# Altium schematic sheet SheildLattePanda.SchDoc
size A; SheetNumber: 2; SheetTotal: 3
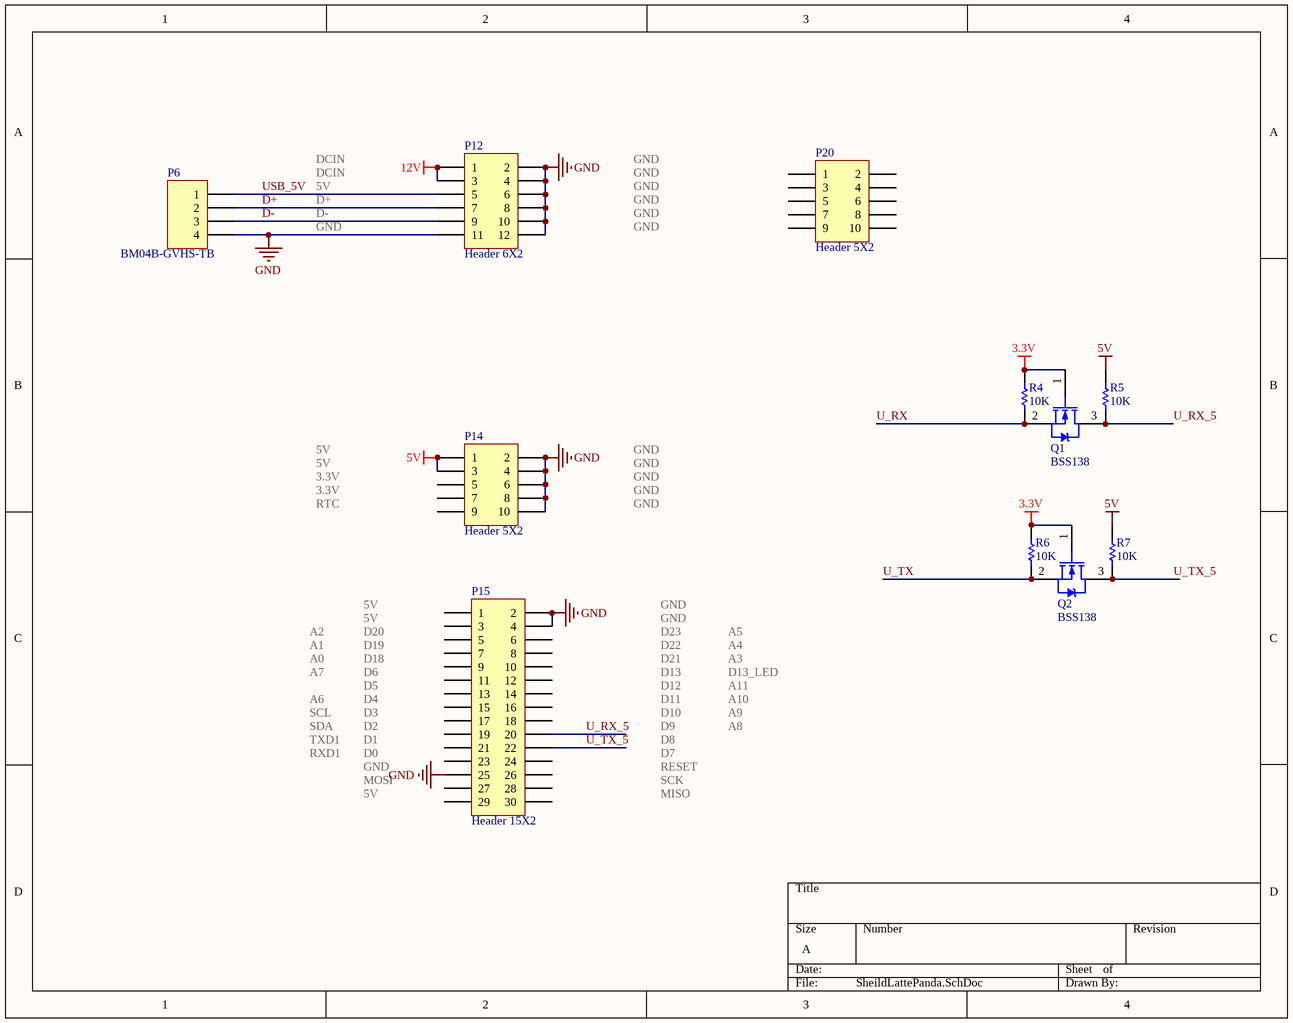
[diagram p0: SheildLattePanda.SchDoc]

## Parts
P6  BM04B-GVHS-TB  [CONN-SM04B-GHSV-TB - INVERTED]
P12  Header 6X2  [CONN-2x6_0_1INCH_SMT - duplicate - duplicate]
P14  Header 5X2  [CONN-2x5_0_1INCH_SMT - duplicate]
P15  Header 15X2  [CONN-2x15_0_1INCH_SMT]
P20  Header 5X2  [CONN-2x5_0_1INCH_SMT - duplicate]
Q1  BSS138  [SOT-23]
Q2  BSS138  [SOT-23]
R4  value 10K  [R0402]  (hidden comment: Res1)
R5  value 10K  [R0402]  (hidden comment: Res1)
R6  value 10K  [R0402]  (hidden comment: Res1)
R7  value 10K  [R0402]  (hidden comment: Res1)

## Nets
3.3V: Q1.1(G) Q2.1(G) R4.1 R6.1
5V: P14.1 P14.3 R5.1 R7.1
12V: P12.1 P12.3
GND: P6.4 P12.2 P12.4 P12.6 P12.8 P12.10 P12.11 P12.12 P14.2 P14.4 P14.6 P14.8 P14.10 P15.2 P15.4 P15.25
D+: P6.2 P12.7
D-: P6.3 P12.9
U_RX: Q1.2(S) R4.2
U_RX_5: P15.20 Q1.3(D) R5.2
U_TX: Q2.2(S) R6.2
U_TX_5: P15.22 Q2.3(D) R7.2
USB_5V: P6.1 P12.5

Not connected (* = marked no-connect by the designer): P14 5 7 9; P15 1 3 5 6 7 8 9 10 11 12 13 14 15 16 17 18 19 21 23 24 26 27 28 29 30; P20 1 2 3 4 5 6 7 8 9 10

## Notes on the sheet
- DCIN
- GND
- 5V
- D+
- D-
- 3.3V
- RTC
- A2
- D20
- D23
- A5
- A1
- A0
- A7
- A6
- D19
- D18
- D6
- D5
- D4
- D22
- D21
- D13
- D12
- D11
- A4
- A3
- D13_LED
- A11
- A10
- SCL
- SDA
- TXD1
- RXD1
- D3
- D2
- D1
- D0
- D10
- D9
- D8
- D7
- RESET
- A9
- A8
- MOSI
- SCK
- MISO

## Library data of the parts
P6 = Header 4: Conn Header SMD 4POS 1.25MM; Manufacturer: JST; Supplier 1: DigiKey; Supplier Part Number 1: 455-BM04B-GVHS-TBCT-ND; Manufacturer Part Number: BM04B-GVHS-TB; Stock 1: 920; Pricing 1: 1=0.5, 10=0.422, 100=0.3284, 500=0.2815, 1000=0.23458 (USD)
P12 = Header 6X2: Conn Unshrouded Header HDR 12 POS 2.54mm Solder ST Top Entry SMD T/R; Manufacturer: Amphenol ICC / FCI; Manufacturer Part Number: 10129383-912002ALF; LatestRevisionDate: 17-Jul-2002; LatestRevisionNote: Re-released for DXP Platform.; Publisher: Altium Limited; Supplier 1: Digi-Key; Supplier Part Number 1: 609-10129383-912002ALFCT-ND; RoHS: No; Category: Connectors; Stock 1: 1060; Pricing 1: 1=0.6, 10=0.52 (USD)
P14 P20 = Header 5X2: Btb Connector, Header, 10POS, 2ROW, 2.54MM;; Manufacturer: Amphenol Communications Solutions; Manufacturer Part Number: 10129383-910002ALF; Supplier 1: Digi-Key; Supplier Part Number 1: 609-10129383-910002ALFCT-ND; RoHS: No; Stock 1: 14112; Pricing 1: 1=0.48, 10=0.422 (USD)
P15 = Header 15X2: Header, 15-Pin, Dual row; Supplier 1: LCSC; Supplier Part Number 1: C2685170
Q1 Q2 = NMOS-2: N-Channel Power MOSFET; Manufacturer 1: Jiangsu Changjing Electronics; Supplier 1: JLCPCB; Supplier Part Number 1: C78284; Manufacturer Part Number 1: BSS138; Value: BSS138
R4-R7 = Res1: RES SMD 10 KOHM 1% 1/16W 0402; Manufacturer 1: UNI-ROYAL(Uniroyal Elec); Manufacturer Part Number 1: 0402WGF1002TCE; Footprint: 0402; Supplier 1: JLCPCB; Supplier Part Number 1: C25744